# Altium schematic sheet 29. eMMC.SchDoc: eMMC FLASH
size 513 x 386 mm; Project: PROC154E2(001)_SK_AM69; Issue: 1.0; RevCode: E3; Page Create Date: March  8, 1995; Variant Name: Core Design; Schematic Page Number: 29; Page Number: 29; Page Size: C; Comment: MISTRAL_TITLEBLK_CSIZE_1; Page Count: 62; Schematic Page Count: 62; Name: PROC154E2 001 SK AM69; DsnPath: C:\Users\danie\Downloads\sprr466c\PROC154E3_RP\PROC154E3_SCH.DSN; SchematicName: SCHEMATIC1; PageName: 29. eMMC; PageSize: C; TopSchematic: True
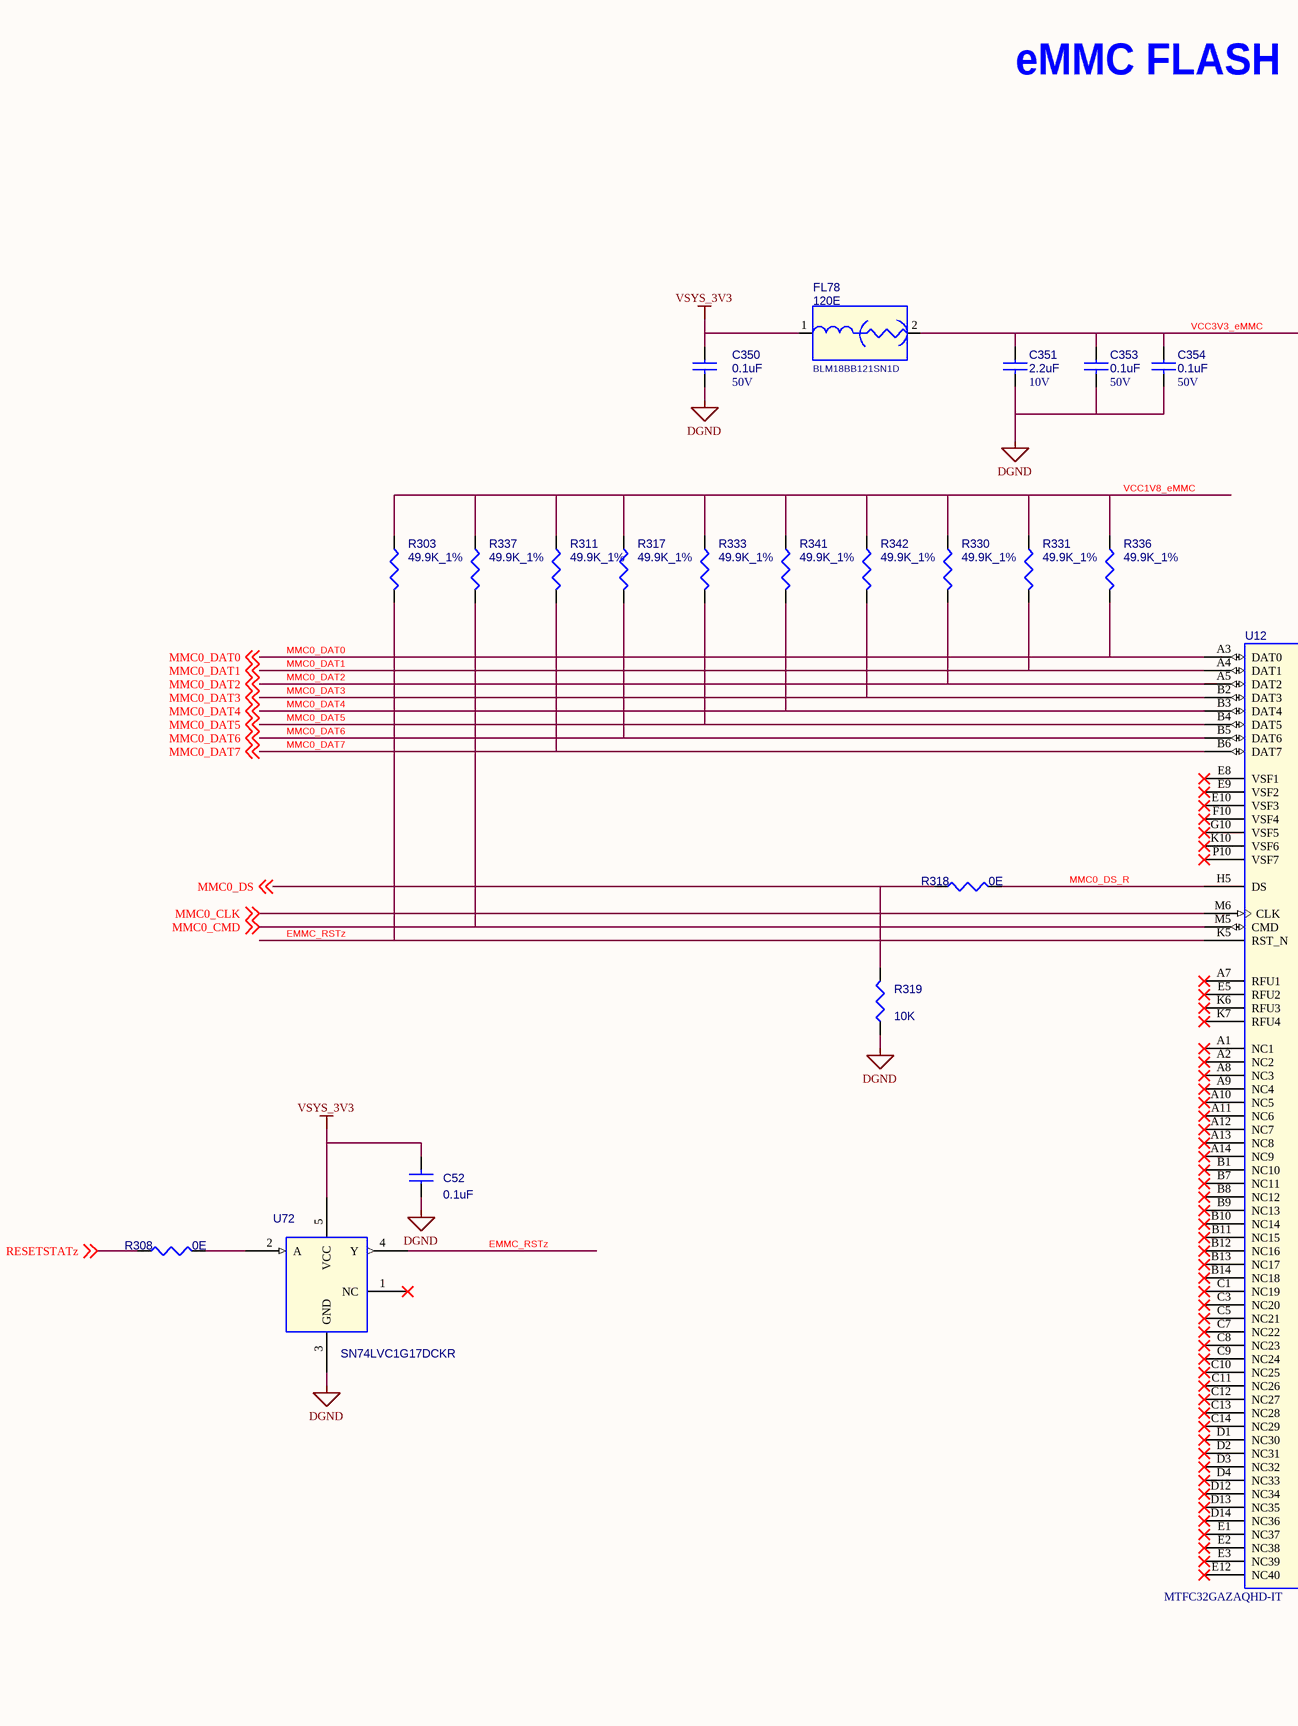
[diagram p0: 29. eMMC.SchDoc, left]
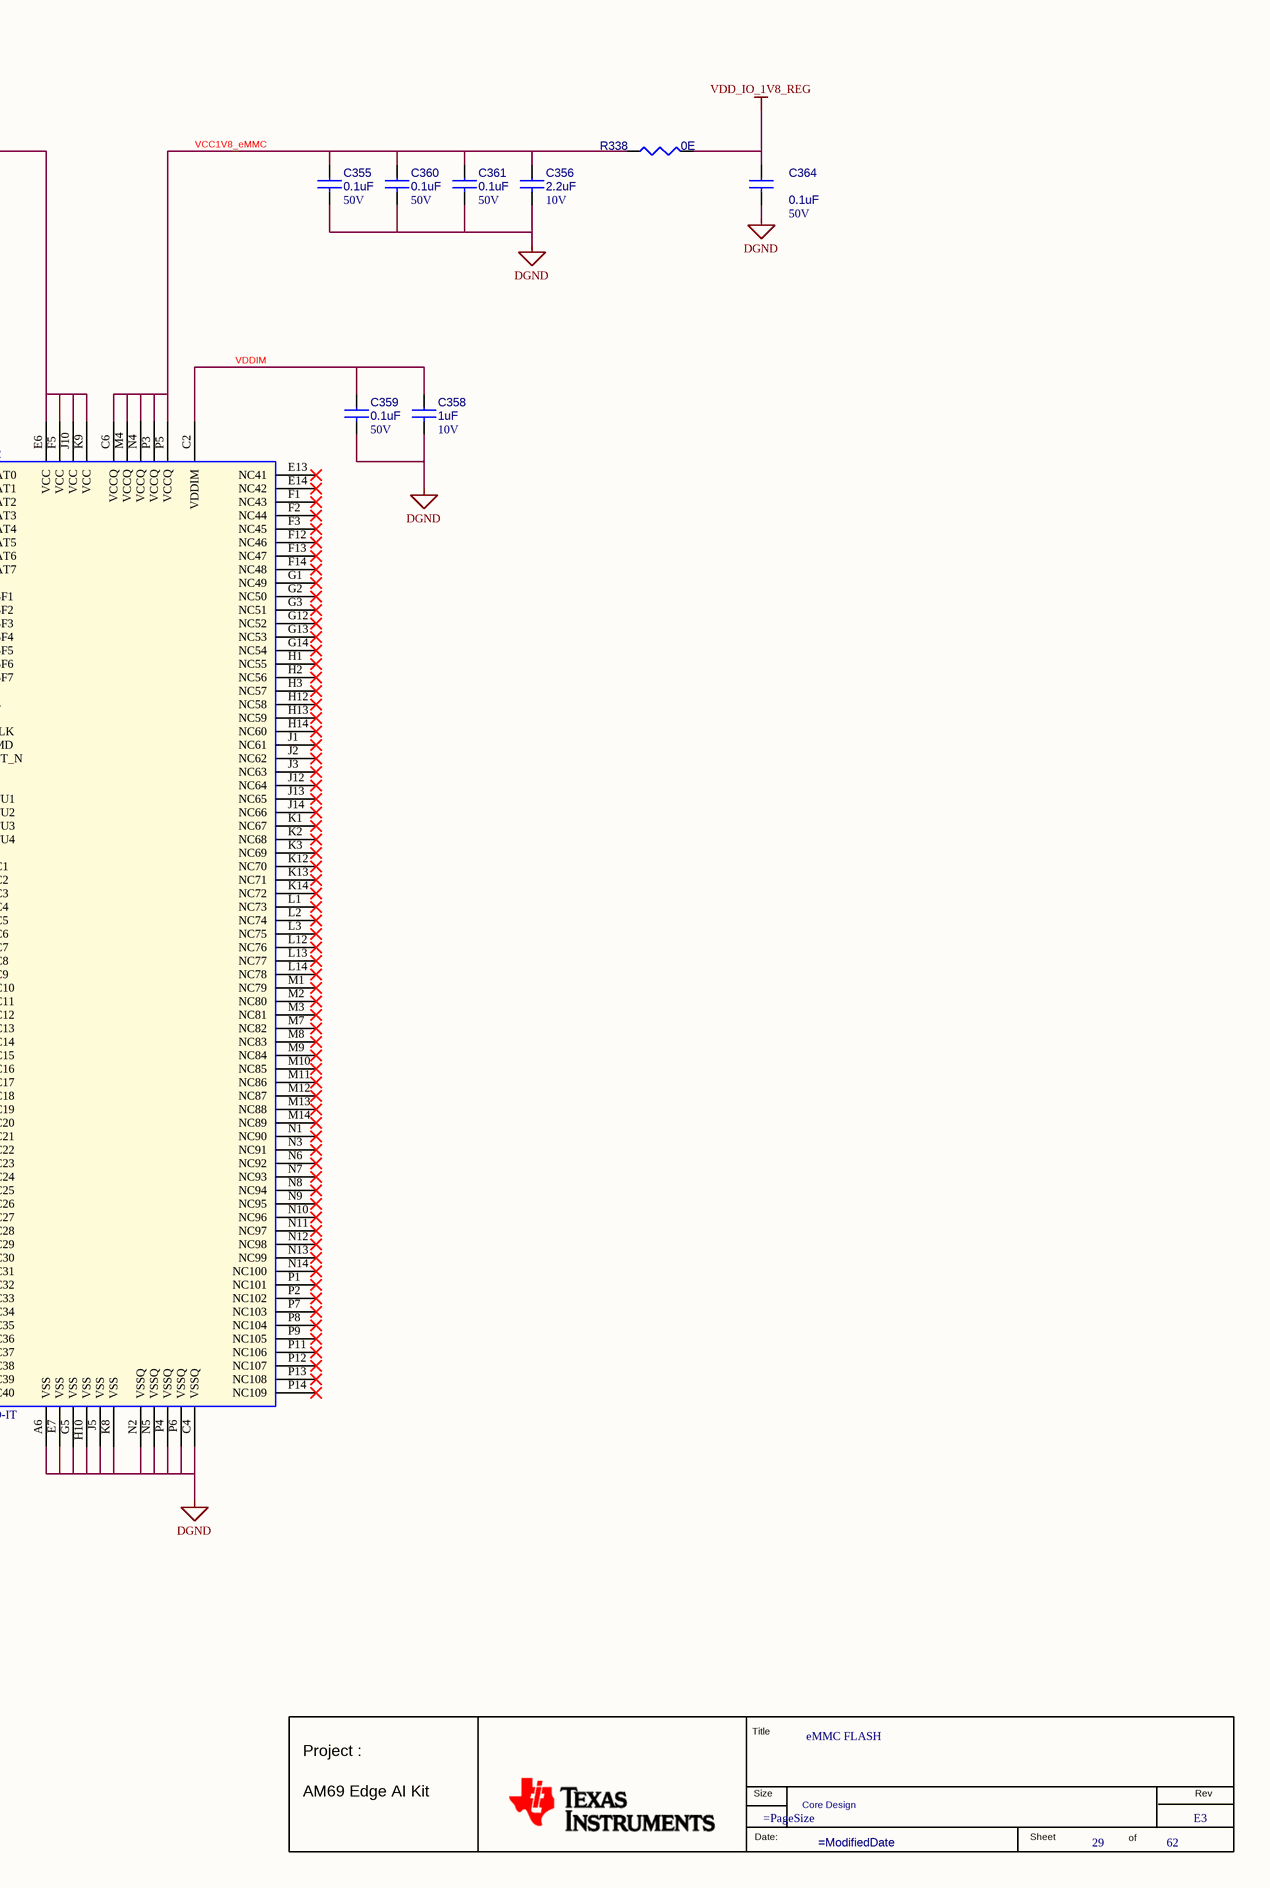
[diagram p1: 29. eMMC.SchDoc, right]

## Parts
*  RevCode: E3  Title: eMMC FLASH  Page Number: 29  Page Count: 62  Variant Name: Core Design  (hidden comment: MISTRAL_TITLEBLK_CSIZE_1)  (graphical)
C52  0.1uF  [CAP0201_0-5]
C350  0.1uF  Voltage: 50V  [CAP0402_0-75]
C351  2.2uF  Voltage: 10V  [CAP0603_1]
C353  0.1uF  Voltage: 50V  [CAP0402_0-75]
C354  0.1uF  Voltage: 50V  [CAP0402_0-75]
C355  0.1uF  Voltage: 50V  [CAP0402_0-75]
C356  2.2uF  Voltage: 10V  [CAP0603_1]
C358  1uF  Voltage: 10V  [CAP0402_0-75]
C359  0.1uF  Voltage: 50V  [CAP0402_0-75]
C360  0.1uF  Voltage: 50V  [CAP0402_0-75]
C361  0.1uF  Voltage: 50V  [CAP0402_0-75]
C364  0.1uF  Voltage: 50V  [CAP0402_0-75]
FL78  120E  Mfr_part_number: BLM18BB121SN1D  [EMIFIL_BLM18A_0603]
R303  49.9K_1%  [RES0402_0-5]
R308  0E  [RES0402_0-5]
R311  49.9K_1%  [RES0402_0-5]
R317  49.9K_1%  [RES0402_0-5]
R318  0E  [RES0402_0-5]
R319  10K  [RES0402_0-5]
R330  49.9K_1%  [RES0402_0-5]
R331  49.9K_1%  [RES0402_0-5]
R333  49.9K_1%  [RES0402_0-5]
R336  49.9K_1%  [RES0402_0-5]
R337  49.9K_1%  [RES0402_0-5]
R338  0E  [RES0402_0-5]
R341  49.9K_1%  [RES0402_0-5]
R342  49.9K_1%  [RES0402_0-5]
U12  MTFC32GAZAQHD-IT  [VFBGA153_19-68_460X520_0-9]
U72  SN74LVC1G17DCKR  [SC70-5]

## Nets
DGND: C52.1 C350.2 C351.2 C353.2 C354.2 C355.2 C356.2 C358.2 C359.2 C360.2 C361.2 C364.2 R319.1 U12.A6(VSS) U12.C4(VSSQ) U12.E7(VSS) U12.G5(VSS) U12.H10(VSS) U12.J5(VSS) U12.K8(VSS) U12.N2(VSSQ) U12.N5(VSSQ) U12.P4(VSSQ) U12.P6(VSSQ) U72.3(GND)
VDD_IO_1V8_REG: C364.1 R338.2
VSYS_3V3: C52.2 C350.1 FL78.1 U72.5(VCC)
EMMC_RSTz: R303.2 U12.K5(RST_N) U72.4(Y)
MMC0_CLK: U12.M6(CLK) ; off-sheet MMC0_CLK
MMC0_CMD: R337.2 U12.M5(CMD) ; off-sheet MMC0_CMD
MMC0_DAT0: R336.2 U12.A3(DAT0) ; off-sheet MMC0_DAT0
MMC0_DAT1: R331.2 U12.A4(DAT1) ; off-sheet MMC0_DAT1
MMC0_DAT2: R330.2 U12.A5(DAT2) ; off-sheet MMC0_DAT2
MMC0_DAT3: R342.2 U12.B2(DAT3) ; off-sheet MMC0_DAT3
MMC0_DAT4: R341.2 U12.B3(DAT4) ; off-sheet MMC0_DAT4
MMC0_DAT5: R333.2 U12.B4(DAT5) ; off-sheet MMC0_DAT5
MMC0_DAT6: R317.2 U12.B5(DAT6) ; off-sheet MMC0_DAT6
MMC0_DAT7: R311.2 U12.B6(DAT7) ; off-sheet MMC0_DAT7
MMC0_DS: R318.1 R319.2 ; off-sheet MMC0_DS
MMC0_DS_R: R318.2 U12.H5(DS)
RESETSTATz: R308.1 ; off-sheet RESETSTATz
VCC1V8_eMMC: C355.1 C356.1 C360.1 C361.1 R303.1 R311.1 R317.1 R330.1 R331.1 R333.1 R336.1 R337.1 R338.1 R341.1 R342.1 U12.C6(VCCQ) U12.M4(VCCQ) U12.N4(VCCQ) U12.P3(VCCQ) U12.P5(VCCQ)
VCC3V3_eMMC: C351.1 C353.1 C354.1 FL78.2 U12.E6(VCC) U12.F5(VCC) U12.J10(VCC) U12.K9(VCC)
VDDIM: C358.1 C359.1 U12.C2(VDDIM)
NetR308_2: R308.2 U72.2(A)

Not connected (* = marked no-connect by the designer): U12 A1(NC1)* A2(NC2)* A7(RFU1)* A8(NC3)* A9(NC4)* A10(NC5)* A11(NC6)* A12(NC7)* A13(NC8)* A14(NC9)* B1(NC10)* B7(NC11)* B8(NC12)* B9(NC13)* B10(NC14)* B11(NC15)* B12(NC16)* B13(NC17)* B14(NC18)* C1(NC19)* C3(NC20)* C5(NC21)* C7(NC22)* C8(NC23)* C9(NC24)* C10(NC25)* C11(NC26)* C12(NC27)* C13(NC28)* C14(NC29)* D1(NC30)* D2(NC31)* D3(NC32)* D4(NC33)* D12(NC34)* D13(NC35)* D14(NC36)* E1(NC37)* E2(NC38)* E3(NC39)* E5(RFU2)* E8(VSF1)* E9(VSF2)* E10(VSF3)* E12(NC40)* E13(NC41)* E14(NC42)* F1(NC43)* F2(NC44)* F3(NC45)* F10(VSF4)* F12(NC46)* F13(NC47)* F14(NC48)* G1(NC49)* G2(NC50)* G3(NC51)* G10(VSF5)* G12(NC52)* G13(NC53)* G14(NC54)* H1(NC55)* H2(NC56)* H3(NC57)* H12(NC58)* H13(NC59)* H14(NC60)* J1(NC61)* J2(NC62)* J3(NC63)* J12(NC64)* J13(NC65)* J14(NC66)* K1(NC67)* K2(NC68)* K3(NC69)* K6(RFU3)* K7(RFU4)* K10(VSF6)* K12(NC70)* K13(NC71)* K14(NC72)* L1(NC73)* L2(NC74)* L3(NC75)* L12(NC76)* L13(NC77)* L14(NC78)* M1(NC79)* M2(NC80)* M3(NC81)* M7(NC82)* M8(NC83)* M9(NC84)* M10(NC85)* M11(NC86)* M12(NC87)* M13(NC88)* M14(NC89)* N1(NC90)* N3(NC91)* N6(NC92)* N7(NC93)* N8(NC94)* N9(NC95)* N10(NC96)* N11(NC97)* N12(NC98)* N13(NC99)* N14(NC100)* P1(NC101)* P2(NC102)* P7(NC103)* P8(NC104)* P9(NC105)* P10(VSF7)* P11(NC106)* P12(NC107)* P13(NC108)* P14(NC109)*; U72 1(NC)*

## Notes on the sheet
- eMMC FLASH
- (in symbol MISTRAL_TITLEBLK_CSIZE_1) Title; Project :; Size; Rev; AM69 Edge AI Kit; Date:; Sheet; of

## Library data of the parts
* = MISTRAL_TITLEBLK_CSIZE_1: Issue: 1.0; Project: PROC154E2(001)_SK_AM69; Name: PROC154E2 001 SK AM69; Page Create Date: March  8, 1995; Page Size: =PageSize; Page Modify Date: =ModifiedDate; Schematic Page Count: 62; Schematic Page Number: 29
C52 = CAP_Dup1: CAP CERAMIC 0.1uF 16V 10% X7S AUTO 0201; Part Reference: C52; Part_type: CAPACITORS\CERAMIC; Mfr_part_number: GRT033C71C104KE01D; Mfr_name: MURATA; Mistral Part No: 120021030007-R; Custom_Duty: 15%; Customs_HS_Code: 85322990; Wattage: NA; Project: J7ES_SK_BRD; Value: 0.1uF; PCB Footprint: CAP0201_0-5; MECHANICAL 3D STEP FILE: CAP0201_0-5; Chkd/date: MANIRAJA/110321; Crtd /date: ALVY/110321; Datasheet: Y:\MIS_DATABASE\DATASHEETS\CAPACITORS\GRT033C71C104KE01.PDF; Temperature: -55°C+125°C; Weight: 330mg; Height: 0.33MM; Distributor_part_number: 490-GRT033C71C104KE01DTR-ND; Distributor_name: DIGIKEY; Package: 0201; Voltage: 16V; Tolerance: 10%
C350 = CAP_Dup1: CAP CERAMIC 0.1uF 50V 10% X7R 0402; Part Reference: C350; Part_type: CAPACITORS\CERAMIC; Mfr_part_number: GRM155R71H104KE14D; Mfr_name: MURATA; Mistral Part No: 120011100014-R; Direct Alternate_mfr_name: TDK; Direct Alternate_mfr_part_number: C1005X7R1H104K050BE; Automotive Alternate_mfr_part_number: CGA2B3X7R1H104K050BB; Custom_Duty: 15%; Customs_HS_Code: 85322990; Wattage: NA; Project: J7_CP; Value: 0.1uF; PCB Footprint: CAP0402_0-75; MECHANICAL 3D STEP FILE: CAP0402_0-75; Chkd/date: MANIRAJA/261020; Crtd /date: ALVY/211020; Datasheet: Y:\MIS_DATABASE\DATASHEETS\CAPACITORS\GRM155R71H104KE14.PDF; Temperature: -55°C+125°C; Weight: 3.1mg; Height: 0.55MM; Distributor_part_number: 490-10700-1-ND; Distributor_name: DIGIKEY; Package: 0402; Tolerance: 10%; Library Ref: CAP; Footprint Ref: CAP0402_0-75; Library Path: Y:\MIS_DATABASE\Library\ALTIUM_TOOL\SCHEMATICS_PARTS\MS_DISCRETE_Library.schlib; Footprint Path: Y:\MIS_DATABASE\Library\ALTIUM_TOOL\PCB_FOOTPRINTS\Altium_Footprint_Lib.PcbLib; Automotive Alternate_mfr_name: TDK; Manufacturer: MURATA
C351 = CAP_Dup1: CAP CERAMIC 2.2uF 10V 10% X7S 0603; Part Reference: C351; Manufacturer: MURATA; Automotive Alternate_mfr_part_number: LMK105ABJ225MVHF; Automotive Alternate_mfr_name: TAIYO YUDEN; Direct Alternate_mfr_part_number: C1005X5R1A225K050BC; Direct Alternate_mfr_name: TDK; Part_type: CAPACITORS\CERAMIC; Mfr_part_number: GCM188C71A225KE01; Mistral Part No: 120022090022-R; Custom_Duty: 15%; Customs_HS_Code: 85322990; Wattage: NA; Project: J7AHP_SK_BRD; Value: 2.2uF; MECHANICAL 3D STEP FILE: CAP0603_1; Chkd/date: PRAVEEN/160922; Crtd /date: PRAVEEN/160922; Datasheet: Y:\MIS_DATABASE\DATASHEETS\CAPACITORS\GCM188C71A225KE01.PDF; Temperature: -55°C+125°C; Weight: 6.3mg; Height: 0.90MM; Distributor_part_number: NA; Distributor_name: NA; Package: 0603; Tolerance: 10%; Mfr_name: MURATA; Library Ref: CAP; Footprint Ref: CAP0603_1; Library Path: Y:\MIS_DATABASE\Library\ALTIUM_TOOL\SCHEMATICS_PARTS\MS_DISCRETE_Library.schlib; Footprint Path: Y:\MIS_DATABASE\Library\ALTIUM_TOOL\PCB_FOOTPRINTS\Altium_Footprint_Lib.PcbLib; PCB Footprint: CAP0603_1
C353 = CAP_Dup1: CAP CERAMIC 0.1uF 50V 10% X7R 0402; Part Reference: C353; Manufacturer: MURATA; Automotive Alternate_mfr_part_number: CGA2B3X7R1H104K050BB; Automotive Alternate_mfr_name: TDK; Direct Alternate_mfr_part_number: C1005X7R1H104K050BE; Mistral Part No: 120011100014-R; Mfr_part_number: GRM155R71H104KE14D; Part_type: CAPACITORS\CERAMIC; Project: J7_CP; Wattage: NA; Customs_HS_Code: 85322990; Custom_Duty: 15%; Value: 0.1uF; PCB Footprint: CAP0402_0-75; Direct Alternate_mfr_name: TDK; Library Ref: CAP; Mfr_name: MURATA; Tolerance: 10%; Package: 0402; Distributor_name: DIGIKEY; Distributor_part_number: 490-10700-1-ND; Height: 0.55MM; Weight: 3.1mg; Temperature: -55°C+125°C; Datasheet: Y:\MIS_DATABASE\DATASHEETS\CAPACITORS\GRM155R71H104KE14.PDF; Crtd /date: ALVY/211020; Chkd/date: MANIRAJA/261020; Footprint Ref: CAP0402_0-75; Library Path: Y:\MIS_DATABASE\Library\ALTIUM_TOOL\SCHEMATICS_PARTS\MS_DISCRETE_Library.schlib; Footprint Path: Y:\MIS_DATABASE\Library\ALTIUM_TOOL\PCB_FOOTPRINTS\Altium_Footprint_Lib.PcbLib; MECHANICAL 3D STEP FILE: CAP0402_0-75
C354 = CAP_Dup1: CAP CERAMIC 0.1uF 50V 10% X7R 0402; Part Reference: C354; Manufacturer: MURATA; Automotive Alternate_mfr_part_number: CGA2B3X7R1H104K050BB; Automotive Alternate_mfr_name: TDK; Direct Alternate_mfr_part_number: C1005X7R1H104K050BE; Part_type: CAPACITORS\CERAMIC; Mfr_part_number: GRM155R71H104KE14D; Mistral Part No: 120011100014-R; Custom_Duty: 15%; Customs_HS_Code: 85322990; Wattage: NA; Project: J7_CP; Value: 0.1uF; PCB Footprint: CAP0402_0-75; Direct Alternate_mfr_name: TDK; Chkd/date: MANIRAJA/261020; Crtd /date: ALVY/211020; Datasheet: Y:\MIS_DATABASE\DATASHEETS\CAPACITORS\GRM155R71H104KE14.PDF; Temperature: -55°C+125°C; Weight: 3.1mg; Height: 0.55MM; Distributor_part_number: 490-10700-1-ND; Distributor_name: DIGIKEY; Package: 0402; Tolerance: 10%; Mfr_name: MURATA; Library Ref: CAP; Footprint Ref: CAP0402_0-75; Library Path: Y:\MIS_DATABASE\Library\ALTIUM_TOOL\SCHEMATICS_PARTS\MS_DISCRETE_Library.schlib; Footprint Path: Y:\MIS_DATABASE\Library\ALTIUM_TOOL\PCB_FOOTPRINTS\Altium_Footprint_Lib.PcbLib; MECHANICAL 3D STEP FILE: CAP0402_0-75
C355 = CAP_Dup1: CAP CERAMIC 0.1uF 50V 10% X7R 0402; Part Reference: C355; Manufacturer: MURATA; Automotive Alternate_mfr_part_number: CGA2B3X7R1H104K050BB; Automotive Alternate_mfr_name: TDK; Direct Alternate_mfr_part_number: C1005X7R1H104K050BE; Part_type: CAPACITORS\CERAMIC; Mfr_part_number: GRM155R71H104KE14D; Mistral Part No: 120011100014-R; Custom_Duty: 15%; Customs_HS_Code: 85322990; Wattage: NA; Project: J7_CP; Value: 0.1uF; PCB Footprint: CAP0402_0-75; Direct Alternate_mfr_name: TDK; Footprint Path: Y:\MIS_DATABASE\Library\ALTIUM_TOOL\PCB_FOOTPRINTS\Altium_Footprint_Lib.PcbLib; Library Path: Y:\MIS_DATABASE\Library\ALTIUM_TOOL\SCHEMATICS_PARTS\MS_DISCRETE_Library.schlib; Footprint Ref: CAP0402_0-75; Chkd/date: MANIRAJA/261020; Crtd /date: ALVY/211020; Datasheet: Y:\MIS_DATABASE\DATASHEETS\CAPACITORS\GRM155R71H104KE14.PDF; Temperature: -55°C+125°C; Weight: 3.1mg; Height: 0.55MM; Distributor_part_number: 490-10700-1-ND; Distributor_name: DIGIKEY; Package: 0402; Tolerance: 10%; Mfr_name: MURATA; Library Ref: CAP; MECHANICAL 3D STEP FILE: CAP0402_0-75
C356 = CAP_Dup1: CAP CERAMIC 2.2uF 10V 10% X7S 0603; Part Reference: C356; Manufacturer: MURATA; Automotive Alternate_mfr_part_number: LMK105ABJ225MVHF; Automotive Alternate_mfr_name: TAIYO YUDEN; Direct Alternate_mfr_part_number: C1005X5R1A225K050BC; Direct Alternate_mfr_name: TDK; Part_type: CAPACITORS\CERAMIC; Mfr_part_number: GCM188C71A225KE01; Mistral Part No: 120022090022-R; Custom_Duty: 15%; Customs_HS_Code: 85322990; Wattage: NA; Project: J7AHP_SK_BRD; Value: 2.2uF; MECHANICAL 3D STEP FILE: CAP0603_1; Chkd/date: PRAVEEN/160922; Crtd /date: PRAVEEN/160922; Datasheet: Y:\MIS_DATABASE\DATASHEETS\CAPACITORS\GCM188C71A225KE01.PDF; Temperature: -55°C+125°C; Weight: 6.3mg; Height: 0.90MM; Distributor_part_number: NA; Distributor_name: NA; Package: 0603; Tolerance: 10%; Mfr_name: MURATA; Library Ref: CAP; Footprint Ref: CAP0603_1; Library Path: Y:\MIS_DATABASE\Library\ALTIUM_TOOL\SCHEMATICS_PARTS\MS_DISCRETE_Library.schlib; Footprint Path: Y:\MIS_DATABASE\Library\ALTIUM_TOOL\PCB_FOOTPRINTS\Altium_Footprint_Lib.PcbLib; PCB Footprint: CAP0603_1
C358 = CAP_Dup1: CAP CERAMIC 1uF 10V 10% X7S AUTO 0402; Part Reference: C358; Manufacturer: TDK CORPORATION; Automotive Alternate_mfr_part_number: EMK105BJ105KVHF; Automotive Alternate_mfr_name: TAIYO YUDEN; Direct Alternate_mfr_part_number: CC0402KRX5R7BB105; Direct Alternate_mfr_name: YAGEO AMERICA; Part_type: CAPACITORS\CERAMIC; Mfr_part_number: GCM155C71A105KE38D; Mfr_name: MURATA; Mistral Part No: 120018090021-R; Custom_Duty: 15%; Customs_HS_Code: 85322990; Wattage: NA; Project: SMART-M_SCRIPTALK_PB; Value: 1uF; PCB Footprint: CAP0402_0-75; Footprint Path: Y:\MIS_DATABASE\Library\ALTIUM_TOOL\PCB_FOOTPRINTS\Altium_Footprint_Lib.PcbLib; Library Path: Y:\MIS_DATABASE\Library\ALTIUM_TOOL\SCHEMATICS_PARTS\MS_DISCRETE_Library.schlib; MECHANICAL 3D STEP FILE: CAP0402_0-75; Chkd/date: MANIRAJA/100918; Crtd /date: ALVY/100918; Datasheet: Y:\MIS_DATABASE\DATASHEETS\CAPACITORS\MURATA-GCM-SER.PDF; Temperature: -55°C+125°C; Weight: 6mg; Height: 0.70MM; Library Ref: CAP; Distributor_part_number: 490-13409-1-ND; Distributor_name: DIGIKEY; Package: 0402; Tolerance: 10%; Footprint Ref: CAP0402_0-75
C359 = CAP_Dup1: CAP CERAMIC 0.1uF 50V 10% X7R 0402; Part Reference: C359; Manufacturer: MURATA; Automotive Alternate_mfr_part_number: CGA2B3X7R1H104K050BB; Automotive Alternate_mfr_name: TDK; Direct Alternate_mfr_part_number: C1005X7R1H104K050BE; Mistral Part No: 120011100014-R; Mfr_part_number: GRM155R71H104KE14D; Part_type: CAPACITORS\CERAMIC; Project: J7_CP; Wattage: NA; Customs_HS_Code: 85322990; Custom_Duty: 15%; Value: 0.1uF; PCB Footprint: CAP0402_0-75; Direct Alternate_mfr_name: TDK; Footprint Ref: CAP0402_0-75; Mfr_name: MURATA; Tolerance: 10%; Package: 0402; Distributor_name: DIGIKEY; Distributor_part_number: 490-10700-1-ND; Library Ref: CAP; Height: 0.55MM; Weight: 3.1mg; Temperature: -55°C+125°C; Datasheet: Y:\MIS_DATABASE\DATASHEETS\CAPACITORS\GRM155R71H104KE14.PDF; Crtd /date: ALVY/211020; Chkd/date: MANIRAJA/261020; Library Path: Y:\MIS_DATABASE\Library\ALTIUM_TOOL\SCHEMATICS_PARTS\MS_DISCRETE_Library.schlib; Footprint Path: Y:\MIS_DATABASE\Library\ALTIUM_TOOL\PCB_FOOTPRINTS\Altium_Footprint_Lib.PcbLib; MECHANICAL 3D STEP FILE: CAP0402_0-75
C360 = CAP_Dup1: CAP CERAMIC 0.1uF 50V 10% X7R 0402; Part Reference: C360; Manufacturer: MURATA; Automotive Alternate_mfr_part_number: CGA2B3X7R1H104K050BB; Automotive Alternate_mfr_name: TDK; Direct Alternate_mfr_part_number: C1005X7R1H104K050BE; Part_type: CAPACITORS\CERAMIC; Mfr_part_number: GRM155R71H104KE14D; Mistral Part No: 120011100014-R; Custom_Duty: 15%; Customs_HS_Code: 85322990; Wattage: NA; Project: J7_CP; Value: 0.1uF; PCB Footprint: CAP0402_0-75; Direct Alternate_mfr_name: TDK; Footprint Path: Y:\MIS_DATABASE\Library\ALTIUM_TOOL\PCB_FOOTPRINTS\Altium_Footprint_Lib.PcbLib; Library Path: Y:\MIS_DATABASE\Library\ALTIUM_TOOL\SCHEMATICS_PARTS\MS_DISCRETE_Library.schlib; Footprint Ref: CAP0402_0-75; Chkd/date: MANIRAJA/261020; Crtd /date: ALVY/211020; Datasheet: Y:\MIS_DATABASE\DATASHEETS\CAPACITORS\GRM155R71H104KE14.PDF; Temperature: -55°C+125°C; Weight: 3.1mg; Height: 0.55MM; Distributor_part_number: 490-10700-1-ND; Distributor_name: DIGIKEY; Package: 0402; Tolerance: 10%; Mfr_name: MURATA; Library Ref: CAP; MECHANICAL 3D STEP FILE: CAP0402_0-75
C361 = CAP_Dup1: CAP CERAMIC 0.1uF 50V 10% X7R 0402; Part Reference: C361; Manufacturer: MURATA; Automotive Alternate_mfr_part_number: CGA2B3X7R1H104K050BB; Automotive Alternate_mfr_name: TDK; Direct Alternate_mfr_part_number: C1005X7R1H104K050BE; Part_type: CAPACITORS\CERAMIC; Mfr_part_number: GRM155R71H104KE14D; Mistral Part No: 120011100014-R; Custom_Duty: 15%; Customs_HS_Code: 85322990; Wattage: NA; Project: J7_CP; Value: 0.1uF; PCB Footprint: CAP0402_0-75; Direct Alternate_mfr_name: TDK; Footprint Path: Y:\MIS_DATABASE\Library\ALTIUM_TOOL\PCB_FOOTPRINTS\Altium_Footprint_Lib.PcbLib; Library Path: Y:\MIS_DATABASE\Library\ALTIUM_TOOL\SCHEMATICS_PARTS\MS_DISCRETE_Library.schlib; Footprint Ref: CAP0402_0-75; Chkd/date: MANIRAJA/261020; Crtd /date: ALVY/211020; Datasheet: Y:\MIS_DATABASE\DATASHEETS\CAPACITORS\GRM155R71H104KE14.PDF; Temperature: -55°C+125°C; Weight: 3.1mg; Height: 0.55MM; Distributor_part_number: 490-10700-1-ND; Distributor_name: DIGIKEY; Package: 0402; Tolerance: 10%; Mfr_name: MURATA; Library Ref: CAP; MECHANICAL 3D STEP FILE: CAP0402_0-75
C364 = CAP_Dup1: CAP CERAMIC 0.1uF 50V 10% X7R 0402; Part Reference: C364; Manufacturer: MURATA; Automotive Alternate_mfr_part_number: CGA2B3X7R1H104K050BB; Automotive Alternate_mfr_name: TDK; Direct Alternate_mfr_part_number: C1005X7R1H104K050BE; Mistral Part No: 120011100014-R; Mfr_part_number: GRM155R71H104KE14D; Part_type: CAPACITORS\CERAMIC; Project: J7_CP; Wattage: NA; Customs_HS_Code: 85322990; Custom_Duty: 15%; Value: 0.1uF; PCB Footprint: CAP0402_0-75; Direct Alternate_mfr_name: TDK; Footprint Path: Y:\MIS_DATABASE\Library\ALTIUM_TOOL\PCB_FOOTPRINTS\Altium_Footprint_Lib.PcbLib; Library Path: Y:\MIS_DATABASE\Library\ALTIUM_TOOL\SCHEMATICS_PARTS\MS_DISCRETE_Library.schlib; Footprint Ref: CAP0402_0-75; Library Ref: CAP; Mfr_name: MURATA; Tolerance: 10%; Package: 0402; Distributor_name: DIGIKEY; Distributor_part_number: 490-10700-1-ND; Height: 0.55MM; Weight: 3.1mg; Temperature: -55°C+125°C; Datasheet: Y:\MIS_DATABASE\DATASHEETS\CAPACITORS\GRM155R71H104KE14.PDF; Crtd /date: ALVY/211020; Chkd/date: MANIRAJA/261020; MECHANICAL 3D STEP FILE: CAP0402_0-75
FL78 = EMIFILTER_IND: PASSIVE FILTER EMI 120E 0603; Part Reference: FL78; Manufacturer: MURATA; Automotive Alternate_mfr_part_number: MMZ1608D121BTD25; Automotive Alternate_mfr_name: TDK; Direct Alternate_mfr_part_number: MMZ1608D121BTA00; Mistral Part No: 130009030758; Project: OMAP_EVM; Customs_HS_Code: 85437099; Custom_Duty: 24%; Value: 120E; PCB Footprint: EMIFIL_BLM18A_0603; Direct Alternate_mfr_name: TDK; Mfr_name: MURATA; Part_type: FILTER; Package: 0603; Distributor_name: DIGIKEY; Distributor_part_number: 490-1020-1-ND; Library Ref: EMIFILTER_IND; Height: 0.95MM; Datasheet: Y:\MIS_DATABASE\DATASHEETS\ICS\MISC\BLM18B.PDF; Crtd /date: USMAN/070109; Chkd/date: MAZHAR/030809
R303 = RESISTOR_Dup2: RES 49.9K 1/16W 1% 0402; Part Reference: R303; Manufacturer: YAGEO AMERICA; Part_type: RESISTORS\FIXED; Mfr_part_number: RC0402FR-0749K9L; Mistral Part No: 110009030902-R; Custom_Duty: 15%; Customs_HS_Code: 85332119; Project: PNAV; Voltage: NA; Value: 49.9K_1%; PCB Footprint: RES0402_0-5; Chkd/date: MAZHAR/220709; Crtd /date: GEETHA/090606; Datasheet: Y:\MIS_DATABASE\DATASHEETS\RESISTORS\RCXXXXL-SER_MAR18.PDF; Height: 0.40MM; Distributor_part_number: 311-49.9KLRCT-ND; Distributor_name: DIGIKEY; Package: 0402; Wattage: 1/16W; Tolerance: 1%; Mfr_name: YAGEO AMERICA; Library Ref: RESISTOR; Footprint Ref: RES0402_0-5; Weight: 0.65mg; Temperature: -55°C+155°C; MECHANICAL 3D STEP FILE: RES0402_0-5; Library Path: Y:\MIS_DATABASE\Library\ALTIUM_TOOL\SCHEMATICS_PARTS\MS_DISCRETE_Library.schlib; Footprint Path: Y:\MIS_DATABASE\Library\ALTIUM_TOOL\PCB_FOOTPRINTS\Altium_Footprint_Lib.PcbLib
R308 = RESISTOR_Dup2: RES 0E 1/10W JUMPER 0402; Part Reference: R308; Manufacturer: PANASONIC-ECG; Part_type: RESISTORS\FIXED; Mfr_part_number: ERJ-2GE0R00X; Mistral Part No: 110018030052-R; IBISSP_MODLES: VALUE REPEATING 2 TIME; Custom_Duty: 15%; Customs_HS_Code: 85332119; Voltage: NA; Project: AEGIS POM; Value: 0E; PCB Footprint: RES0402_0-5; Chkd/date: VASANTHA/061216; Crtd /date: NAVEED/201014; Datasheet: Y:\MIS_DATABASE\DATASHEETS\RESISTORS\PAN-ERJSER_NOV17.PDF; Temperature: -55°C+155°C; Weight: 0.8mg; Height: 0.40MM; Library Ref: RESISTOR; Distributor_part_number: P0.0JCT-ND; Distributor_name: DIGIKEY; Package: 0402; Wattage: 1/10W; Tolerance: NA; Mfr_name: PANASONIC-ECG; Footprint Ref: RES0402_0-5; MECHANICAL 3D STEP FILE: RES0402_0-5; Library Path: Y:\MIS_DATABASE\Library\ALTIUM_TOOL\SCHEMATICS_PARTS\MS_DISCRETE_Library.schlib; Footprint Path: Y:\MIS_DATABASE\Library\ALTIUM_TOOL\PCB_FOOTPRINTS\Altium_Footprint_Lib.PcbLib
R311 = RESISTOR_Dup2: RES 49.9K 1/16W 1% 0402; Part Reference: R311; Manufacturer: YAGEO AMERICA; Part_type: RESISTORS\FIXED; Mfr_part_number: RC0402FR-0749K9L; Mistral Part No: 110009030902-R; Custom_Duty: 15%; Customs_HS_Code: 85332119; Project: PNAV; Voltage: NA; Value: 49.9K_1%; PCB Footprint: RES0402_0-5; Chkd/date: MAZHAR/220709; Crtd /date: GEETHA/090606; Datasheet: Y:\MIS_DATABASE\DATASHEETS\RESISTORS\RCXXXXL-SER_MAR18.PDF; Height: 0.40MM; Distributor_part_number: 311-49.9KLRCT-ND; Distributor_name: DIGIKEY; Package: 0402; Wattage: 1/16W; Tolerance: 1%; Mfr_name: YAGEO AMERICA; Library Ref: RESISTOR; Footprint Ref: RES0402_0-5; Weight: 0.65mg; Temperature: -55°C+155°C; MECHANICAL 3D STEP FILE: RES0402_0-5; Library Path: Y:\MIS_DATABASE\Library\ALTIUM_TOOL\SCHEMATICS_PARTS\MS_DISCRETE_Library.schlib; Footprint Path: Y:\MIS_DATABASE\Library\ALTIUM_TOOL\PCB_FOOTPRINTS\Altium_Footprint_Lib.PcbLib
R317 = RESISTOR_Dup2: RES 49.9K 1/16W 1% 0402; Part Reference: R317; Manufacturer: YAGEO AMERICA; Mistral Part No: 110009030902-R; Mfr_part_number: RC0402FR-0749K9L; Part_type: RESISTORS\FIXED; Project: PNAV; Customs_HS_Code: 85332119; Custom_Duty: 15%; Voltage: NA; Value: 49.9K_1%; PCB Footprint: RES0402_0-5; Library Ref: RESISTOR; Mfr_name: YAGEO AMERICA; Tolerance: 1%; Wattage: 1/16W; Package: 0402; Distributor_name: DIGIKEY; Distributor_part_number: 311-49.9KLRCT-ND; Height: 0.40MM; Datasheet: Y:\MIS_DATABASE\DATASHEETS\RESISTORS\RCXXXXL-SER_MAR18.PDF; Crtd /date: GEETHA/090606; Chkd/date: MAZHAR/220709; Footprint Ref: RES0402_0-5; Weight: 0.65mg; Temperature: -55°C+155°C; MECHANICAL 3D STEP FILE: RES0402_0-5; Library Path: Y:\MIS_DATABASE\Library\ALTIUM_TOOL\SCHEMATICS_PARTS\MS_DISCRETE_Library.schlib; Footprint Path: Y:\MIS_DATABASE\Library\ALTIUM_TOOL\PCB_FOOTPRINTS\Altium_Footprint_Lib.PcbLib
R318 = RESISTOR_Dup2: RES 0E 1/10W JUMPER 0402; Part Reference: R318; Manufacturer: PANASONIC-ECG; Part_type: RESISTORS\FIXED; Mfr_part_number: ERJ-2GE0R00X; Mistral Part No: 110018030052-R; IBISSP_MODLES: VALUE REPEATING 2 TIME; Custom_Duty: 15%; Customs_HS_Code: 85332119; Voltage: NA; Project: AEGIS POM; SIGNAL_MODEL: RESISTOR_RES0402_0-5_0E_0E; Value: 0E; PCB Footprint: RES0402_0-5; Chkd/date: VASANTHA/061216; Crtd /date: NAVEED/201014; Datasheet: Y:\MIS_DATABASE\DATASHEETS\RESISTORS\PAN-ERJSER_NOV17.PDF; Temperature: -55°C+155°C; Weight: 0.8mg; Height: 0.40MM; Library Ref: RESISTOR; Distributor_part_number: P0.0JCT-ND; Distributor_name: DIGIKEY; Package: 0402; Wattage: 1/10W; Tolerance: NA; Mfr_name: PANASONIC-ECG; Footprint Ref: RES0402_0-5; MECHANICAL 3D STEP FILE: RES0402_0-5; Library Path: Y:\MIS_DATABASE\Library\ALTIUM_TOOL\SCHEMATICS_PARTS\MS_DISCRETE_Library.schlib; Footprint Path: Y:\MIS_DATABASE\Library\ALTIUM_TOOL\PCB_FOOTPRINTS\Altium_Footprint_Lib.PcbLib
R319 = RESISTOR_Dup2: RES 10K 1/16W 5% 0402; Part Reference: R319; Manufacturer: YAGEO AMERICA; Part_type: RESISTORS\FIXED; Mfr_part_number: RC0402JR-0710KL; Mistral Part No: 110011060021-R; Custom_Duty: 15%; Customs_HS_Code: 85332119; Voltage: NA; Project: HSE; Value: 10K; PCB Footprint: RES0402_0-5; Footprint Path: Y:\MIS_DATABASE\Library\ALTIUM_TOOL\PCB_FOOTPRINTS\Altium_Footprint_Lib.PcbLib; Library Path: Y:\MIS_DATABASE\Library\ALTIUM_TOOL\SCHEMATICS_PARTS\MS_DISCRETE_Library.schlib; Footprint Ref: RES0402_0-5; Library Ref: RESISTOR; MECHANICAL 3D STEP FILE: RES0402_0-5; Chkd/date: VASANTHA/061216; Crtd /date: MAZHAR/230805; Datasheet: Y:\MIS_DATABASE\DATASHEETS\RESISTORS\RCXXXXL-SER_MAR18.PDF; Temperature: -55°C+155°C; Weight: 0.65mg; Height: 0.40MM; Distributor_part_number: 311-10KJRCT-ND; Distributor_name: DIGIKEY; Package: 0402; Wattage: 1/16W; Tolerance: 5%; Mfr_name: YAGEO AMERICA
R330 = RESISTOR_Dup2: RES 49.9K 1/16W 1% 0402; Part Reference: R330; Manufacturer: YAGEO AMERICA; Mistral Part No: 110009030902-R; Mfr_part_number: RC0402FR-0749K9L; Part_type: RESISTORS\FIXED; Project: PNAV; Customs_HS_Code: 85332119; Custom_Duty: 15%; Voltage: NA; Value: 49.9K_1%; PCB Footprint: RES0402_0-5; Library Ref: RESISTOR; Mfr_name: YAGEO AMERICA; Tolerance: 1%; Wattage: 1/16W; Package: 0402; Distributor_name: DIGIKEY; Distributor_part_number: 311-49.9KLRCT-ND; Height: 0.40MM; Datasheet: Y:\MIS_DATABASE\DATASHEETS\RESISTORS\RCXXXXL-SER_MAR18.PDF; Crtd /date: GEETHA/090606; Chkd/date: MAZHAR/220709; Footprint Ref: RES0402_0-5; Weight: 0.65mg; Temperature: -55°C+155°C; MECHANICAL 3D STEP FILE: RES0402_0-5; Library Path: Y:\MIS_DATABASE\Library\ALTIUM_TOOL\SCHEMATICS_PARTS\MS_DISCRETE_Library.schlib; Footprint Path: Y:\MIS_DATABASE\Library\ALTIUM_TOOL\PCB_FOOTPRINTS\Altium_Footprint_Lib.PcbLib
R331 = RESISTOR_Dup2: RES 49.9K 1/16W 1% 0402; Part Reference: R331; Manufacturer: YAGEO AMERICA; Part_type: RESISTORS\FIXED; Mfr_part_number: RC0402FR-0749K9L; Mistral Part No: 110009030902-R; Custom_Duty: 15%; Customs_HS_Code: 85332119; Project: PNAV; Voltage: NA; Value: 49.9K_1%; PCB Footprint: RES0402_0-5; Chkd/date: MAZHAR/220709; Crtd /date: GEETHA/090606; Datasheet: Y:\MIS_DATABASE\DATASHEETS\RESISTORS\RCXXXXL-SER_MAR18.PDF; Height: 0.40MM; Distributor_part_number: 311-49.9KLRCT-ND; Distributor_name: DIGIKEY; Package: 0402; Wattage: 1/16W; Tolerance: 1%; Mfr_name: YAGEO AMERICA; Library Ref: RESISTOR; Footprint Ref: RES0402_0-5; Weight: 0.65mg; Temperature: -55°C+155°C; MECHANICAL 3D STEP FILE: RES0402_0-5; Library Path: Y:\MIS_DATABASE\Library\ALTIUM_TOOL\SCHEMATICS_PARTS\MS_DISCRETE_Library.schlib; Footprint Path: Y:\MIS_DATABASE\Library\ALTIUM_TOOL\PCB_FOOTPRINTS\Altium_Footprint_Lib.PcbLib
R333 = RESISTOR_Dup2: RES 49.9K 1/16W 1% 0402; Part Reference: R333; Manufacturer: YAGEO AMERICA; Part_type: RESISTORS\FIXED; Mfr_part_number: RC0402FR-0749K9L; Mistral Part No: 110009030902-R; Custom_Duty: 15%; Customs_HS_Code: 85332119; Project: PNAV; Voltage: NA; Value: 49.9K_1%; PCB Footprint: RES0402_0-5; Chkd/date: MAZHAR/220709; Crtd /date: GEETHA/090606; Datasheet: Y:\MIS_DATABASE\DATASHEETS\RESISTORS\RCXXXXL-SER_MAR18.PDF; Height: 0.40MM; Distributor_part_number: 311-49.9KLRCT-ND; Distributor_name: DIGIKEY; Package: 0402; Wattage: 1/16W; Tolerance: 1%; Mfr_name: YAGEO AMERICA; Library Ref: RESISTOR; Footprint Ref: RES0402_0-5; Weight: 0.65mg; Temperature: -55°C+155°C; MECHANICAL 3D STEP FILE: RES0402_0-5; Library Path: Y:\MIS_DATABASE\Library\ALTIUM_TOOL\SCHEMATICS_PARTS\MS_DISCRETE_Library.schlib; Footprint Path: Y:\MIS_DATABASE\Library\ALTIUM_TOOL\PCB_FOOTPRINTS\Altium_Footprint_Lib.PcbLib
R336 = RESISTOR_Dup2: RES 49.9K 1/16W 1% 0402; Part Reference: R336; Manufacturer: YAGEO AMERICA; Mistral Part No: 110009030902-R; Mfr_part_number: RC0402FR-0749K9L; Part_type: RESISTORS\FIXED; Project: PNAV; Customs_HS_Code: 85332119; Custom_Duty: 15%; Voltage: NA; Value: 49.9K_1%; PCB Footprint: RES0402_0-5; Library Ref: RESISTOR; Mfr_name: YAGEO AMERICA; Tolerance: 1%; Wattage: 1/16W; Package: 0402; Distributor_name: DIGIKEY; Distributor_part_number: 311-49.9KLRCT-ND; Height: 0.40MM; Datasheet: Y:\MIS_DATABASE\DATASHEETS\RESISTORS\RCXXXXL-SER_MAR18.PDF; Crtd /date: GEETHA/090606; Chkd/date: MAZHAR/220709; Footprint Ref: RES0402_0-5; Weight: 0.65mg; Temperature: -55°C+155°C; MECHANICAL 3D STEP FILE: RES0402_0-5; Library Path: Y:\MIS_DATABASE\Library\ALTIUM_TOOL\SCHEMATICS_PARTS\MS_DISCRETE_Library.schlib; Footprint Path: Y:\MIS_DATABASE\Library\ALTIUM_TOOL\PCB_FOOTPRINTS\Altium_Footprint_Lib.PcbLib
R337 = RESISTOR_Dup2: RES 49.9K 1/16W 1% 0402; Part Reference: R337; Manufacturer: YAGEO AMERICA; Mistral Part No: 110009030902-R; Mfr_part_number: RC0402FR-0749K9L; Part_type: RESISTORS\FIXED; Project: PNAV; Customs_HS_Code: 85332119; Custom_Duty: 15%; Voltage: NA; Value: 49.9K_1%; PCB Footprint: RES0402_0-5; Library Ref: RESISTOR; Mfr_name: YAGEO AMERICA; Tolerance: 1%; Wattage: 1/16W; Package: 0402; Distributor_name: DIGIKEY; Distributor_part_number: 311-49.9KLRCT-ND; Height: 0.40MM; Datasheet: Y:\MIS_DATABASE\DATASHEETS\RESISTORS\RCXXXXL-SER_MAR18.PDF; Crtd /date: GEETHA/090606; Chkd/date: MAZHAR/220709; Footprint Ref: RES0402_0-5; Weight: 0.65mg; Temperature: -55°C+155°C; MECHANICAL 3D STEP FILE: RES0402_0-5; Library Path: Y:\MIS_DATABASE\Library\ALTIUM_TOOL\SCHEMATICS_PARTS\MS_DISCRETE_Library.schlib; Footprint Path: Y:\MIS_DATABASE\Library\ALTIUM_TOOL\PCB_FOOTPRINTS\Altium_Footprint_Lib.PcbLib
R338 = RESISTOR_Dup2: RES 0E 1/10W JUMPER 0402; Part Reference: R338; Part_type: RESISTORS\FIXED; Mfr_part_number: ERJ-2GE0R00X; Mfr_name: PANASONIC-ECG; Mistral Part No: 110018030052-R; Custom_Duty: 15%; Customs_HS_Code: 85332119; Voltage: NA; Project: AEGIS POM; IBISSP_MODLES: VALUE REPEATING 2 TIME; Value: 0E; PCB Footprint: RES0402_0-5; Footprint Path: Y:\MIS_DATABASE\Library\ALTIUM_TOOL\PCB_FOOTPRINTS\Altium_Footprint_Lib.PcbLib; Library Path: Y:\MIS_DATABASE\Library\ALTIUM_TOOL\SCHEMATICS_PARTS\MS_DISCRETE_Library.schlib; MECHANICAL 3D STEP FILE: RES0402_0-5; Chkd/date: VASANTHA/061216; Crtd /date: NAVEED/201014; Datasheet: Y:\MIS_DATABASE\DATASHEETS\RESISTORS\PAN-ERJSER_NOV17.PDF; Temperature: -55°C+155°C; Weight: 0.8mg; Height: 0.40MM; Library Ref: RESISTOR; Distributor_part_number: P0.0JCT-ND; Distributor_name: DIGIKEY; Package: 0402; Wattage: 1/10W; Tolerance: NA; Footprint Ref: RES0402_0-5; Manufacturer: PANASONIC-ECG
R341 = RESISTOR_Dup2: RES 49.9K 1/16W 1% 0402; Part Reference: R341; Manufacturer: YAGEO AMERICA; Mistral Part No: 110009030902-R; Mfr_part_number: RC0402FR-0749K9L; Part_type: RESISTORS\FIXED; Project: PNAV; Customs_HS_Code: 85332119; Custom_Duty: 15%; Voltage: NA; Value: 49.9K_1%; PCB Footprint: RES0402_0-5; Library Ref: RESISTOR; Mfr_name: YAGEO AMERICA; Tolerance: 1%; Wattage: 1/16W; Package: 0402; Distributor_name: DIGIKEY; Distributor_part_number: 311-49.9KLRCT-ND; Height: 0.40MM; Datasheet: Y:\MIS_DATABASE\DATASHEETS\RESISTORS\RCXXXXL-SER_MAR18.PDF; Crtd /date: GEETHA/090606; Chkd/date: MAZHAR/220709; Footprint Ref: RES0402_0-5; Weight: 0.65mg; Temperature: -55°C+155°C; MECHANICAL 3D STEP FILE: RES0402_0-5; Library Path: Y:\MIS_DATABASE\Library\ALTIUM_TOOL\SCHEMATICS_PARTS\MS_DISCRETE_Library.schlib; Footprint Path: Y:\MIS_DATABASE\Library\ALTIUM_TOOL\PCB_FOOTPRINTS\Altium_Footprint_Lib.PcbLib
R342 = RESISTOR_Dup2: RES 49.9K 1/16W 1% 0402; Part Reference: R342; Manufacturer: YAGEO AMERICA; Mistral Part No: 110009030902-R; Mfr_part_number: RC0402FR-0749K9L; Part_type: RESISTORS\FIXED; Project: PNAV; Customs_HS_Code: 85332119; Custom_Duty: 15%; Voltage: NA; Value: 49.9K_1%; PCB Footprint: RES0402_0-5; Library Ref: RESISTOR; Mfr_name: YAGEO AMERICA; Tolerance: 1%; Wattage: 1/16W; Package: 0402; Distributor_name: DIGIKEY; Distributor_part_number: 311-49.9KLRCT-ND; Height: 0.40MM; Datasheet: Y:\MIS_DATABASE\DATASHEETS\RESISTORS\RCXXXXL-SER_MAR18.PDF; Crtd /date: GEETHA/090606; Chkd/date: MAZHAR/220709; Footprint Ref: RES0402_0-5; Weight: 0.65mg; Temperature: -55°C+155°C; MECHANICAL 3D STEP FILE: RES0402_0-5; Library Path: Y:\MIS_DATABASE\Library\ALTIUM_TOOL\SCHEMATICS_PARTS\MS_DISCRETE_Library.schlib; Footprint Path: Y:\MIS_DATABASE\Library\ALTIUM_TOOL\PCB_FOOTPRINTS\Altium_Footprint_Lib.PcbLib
U12 = MTFC16GAPALBH_TFBGA153: IC 32GB e-MMC MEMORY VFBGA153; Part Reference: U12; Manufacturer: MICRON; Mistral Part No: 141122090001-R; Part_type: ICS\DIGITAL\MEMORY; Project: J7AHP_SK_BRD; Tolerance: NA; Customs_HS_Code: 85423100; Custom_Duty: 15%; Value: MTFC32GAZAQHD-IT; Footprint Path: Y:\MIS_DATABASE\Library\ALTIUM_TOOL\PCB_FOOTPRINTS\Altium_Footprint_Lib.PcbLib; Library Path: Y:\MIS_DATABASE\Library\ALTIUM_TOOL\SCHEMATICS_PARTS\MS_MISCMEMORY_Library.schlib; Library Ref: MTFC16GAPALBH_TFBGA153; Footprint Ref: VFBGA153_19-68_460X520_0-9; Mfr_name: MICRON; Mfr_part_number: MTFC32GAZAQHD-IT; Voltage: NA; Wattage: NA; Package: VFBGA153; Distributor_name: DIGIKEY; Distributor_part_number: 557-MTFC32GAZAQHD-IT-ND; Height: 0.90MM; Weight: NA; Temperature: -40°C+95°C; Datasheet: Y:\MIS_DATABASE\DATASHEETS\ICS\MEMORY\MTFC64GAZAQHD-IT.PDF; Crtd /date: PRAVEEN/010922; Chkd/date: PRAVEEN/010922; MECHANICAL 3D STEP FILE: VFBGA153_19-68_460X520_0-9; PCB Footprint: VFBGA153_19-68_460X520_0-9
U72 = SN74LVC1G17DCKR_SC70-5: IC SINGLE SCHMITT-TRIGGER BUFFER SC70-5; Part Reference: U72; Part_type: ICS\DIGITAL\COMBINATIONAL; Mfr_name: TEXAS INSTRUMENTS; Mistral Part No: 141010110012-R; Custom_Duty: 15%; Customs_HS_Code: 85423100; Wattage: NA; Project: ITS-PWR_CARD; Value: SN74LVC1G17DCKR; PCB Footprint: SC70-5; Chkd/date: MAZHAR/011210; Crtd /date: BAVISH/251110; Datasheet: Y:\MIS_DATABASE\DATASHEETS\ICS\DIGITAL\COMBINATIONAL\SN74LVC1G17DCK.PDF; Temperature: -40°C+85°C; Weight: NA; Height: 1.10MM; Library Ref: SN74LVC1G17DCKR_SC70-5; Distributor_part_number: 296-11934-1-ND; Distributor_name: DIGIKEY; Package: SC70-5; Voltage: NA; Tolerance: NA; Mfr_part_number: SN74LVC1G17DCKR